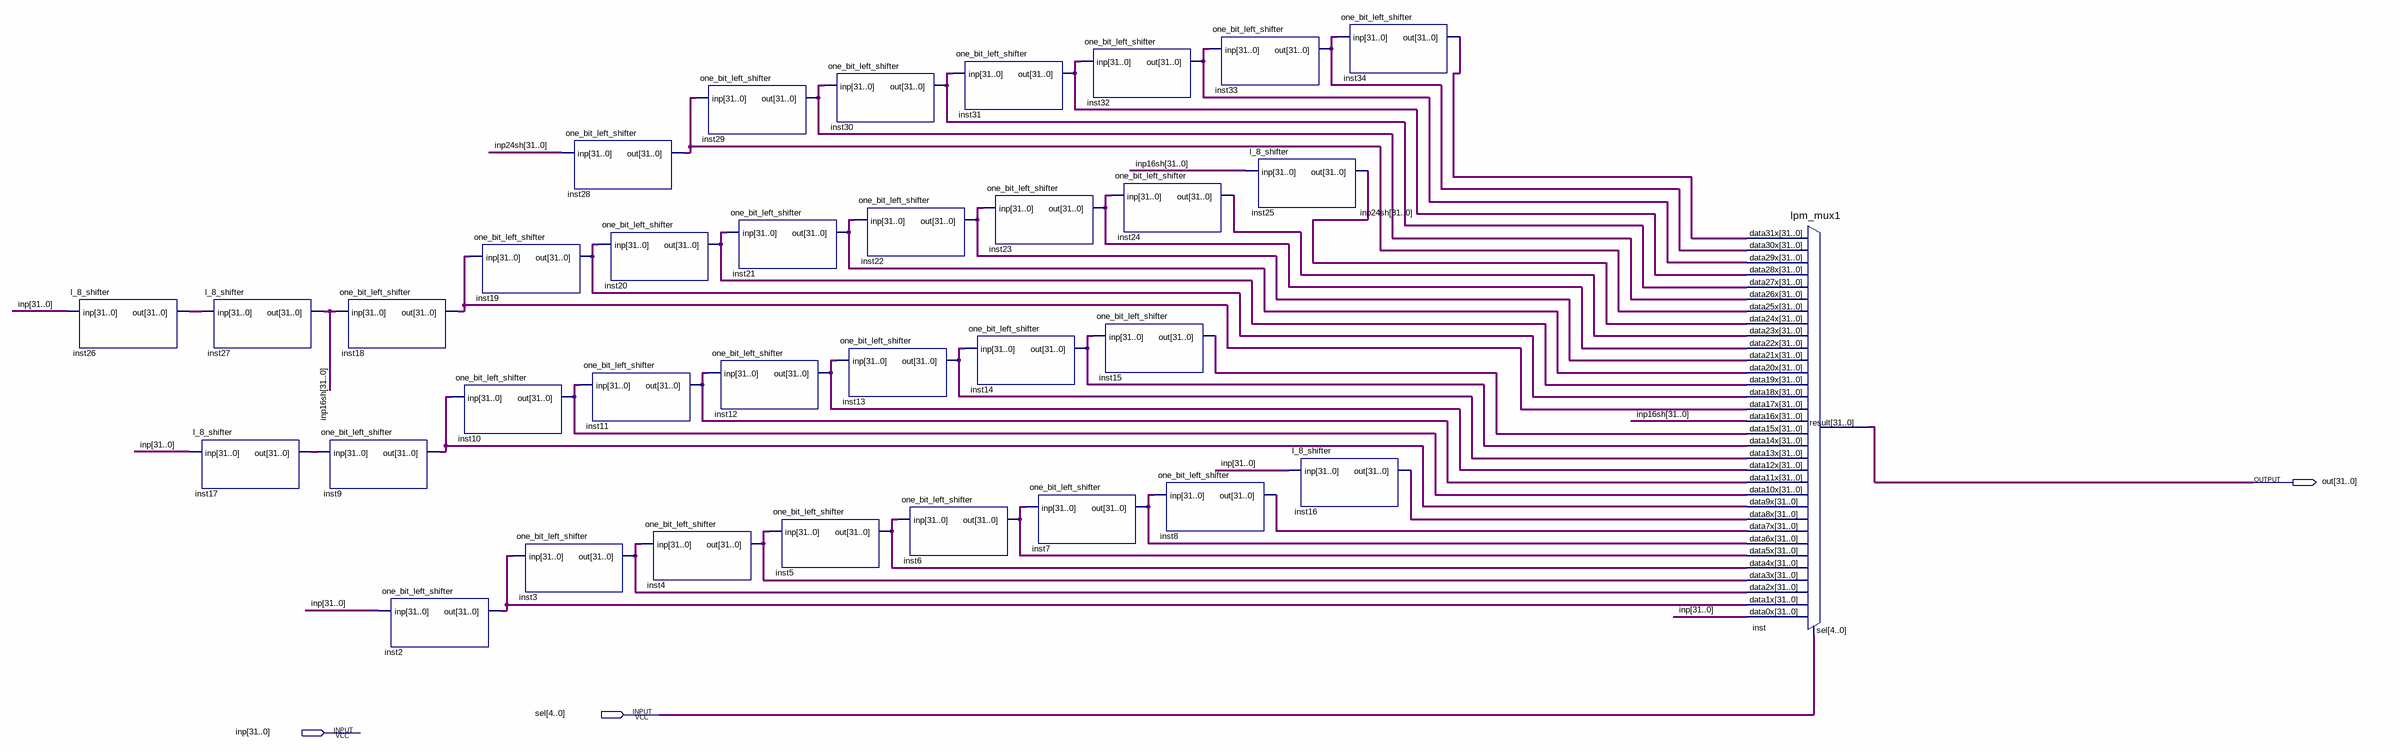
[diagram p0: schematic sheet]
// Quartus schematic left_shifter.bdf as structural Verilog: 34 symbols, 3 pins
module left_shifter (
  input  [4:0] sel,
  input  [31:0] inp,
  output [31:0] out
);

  wire [31:0] inp16sh, inp24sh, inst2_out, inst3_out, inst4_out, inst5_out, inst6_out, inst7_out, inst8_out,
       inst9_out, inst10_out, inst11_out, inst12_out, inst13_out, inst14_out, inst15_out, inst16_out,
       inst17_out, inst18_out, inst19_out, inst20_out, inst21_out, inst22_out, inst23_out, inst24_out,
       inst26_out, inst28_out, inst29_out, inst30_out, inst31_out, inst32_out, inst33_out, inst34_out;

  l_8_shifter inst26 (.inp(inp), .out(inst26_out));
  l_8_shifter inst27 (.inp(inst26_out), .out(inp16sh));
  l_8_shifter inst17 (.inp(inp), .out(inst17_out));
  one_bit_left_shifter inst18 (.inp(inp16sh), .out(inst18_out));
  one_bit_left_shifter inst9 (.inp(inst17_out), .out(inst9_out));
  one_bit_left_shifter inst2 (.inp(inp), .out(inst2_out));
  one_bit_left_shifter inst10 (.inp(inst9_out), .out(inst10_out));
  one_bit_left_shifter inst19 (.inp(inst18_out), .out(inst19_out));
  one_bit_left_shifter inst3 (.inp(inst2_out), .out(inst3_out));
  one_bit_left_shifter inst28 (.inp(inp24sh), .out(inst28_out));
  one_bit_left_shifter inst20 (.inp(inst19_out), .out(inst20_out));
  one_bit_left_shifter inst11 (.inp(inst10_out), .out(inst11_out));
  one_bit_left_shifter inst4 (.inp(inst3_out), .out(inst4_out));
  one_bit_left_shifter inst29 (.inp(inst28_out), .out(inst29_out));
  one_bit_left_shifter inst21 (.inp(inst20_out), .out(inst21_out));
  one_bit_left_shifter inst12 (.inp(inst11_out), .out(inst12_out));
  one_bit_left_shifter inst5 (.inp(inst4_out), .out(inst5_out));
  one_bit_left_shifter inst30 (.inp(inst29_out), .out(inst30_out));
  one_bit_left_shifter inst13 (.inp(inst12_out), .out(inst13_out));
  one_bit_left_shifter inst22 (.inp(inst21_out), .out(inst22_out));
  one_bit_left_shifter inst6 (.inp(inst5_out), .out(inst6_out));
  one_bit_left_shifter inst31 (.inp(inst30_out), .out(inst31_out));
  one_bit_left_shifter inst23 (.inp(inst22_out), .out(inst23_out));
  one_bit_left_shifter inst14 (.inp(inst13_out), .out(inst14_out));
  one_bit_left_shifter inst7 (.inp(inst6_out), .out(inst7_out));
  one_bit_left_shifter inst32 (.inp(inst31_out), .out(inst32_out));
  one_bit_left_shifter inst24 (.inp(inst23_out), .out(inst24_out));
  one_bit_left_shifter inst15 (.inp(inst14_out), .out(inst15_out));
  one_bit_left_shifter inst8 (.inp(inst7_out), .out(inst8_out));
  one_bit_left_shifter inst33 (.inp(inst32_out), .out(inst33_out));
  l_8_shifter inst25 (.inp(inp16sh), .out(inp24sh));
  l_8_shifter inst16 (.inp(inp), .out(inst16_out));
  one_bit_left_shifter inst34 (.inp(inst33_out), .out(inst34_out));
  lpm_mux1 inst (
    .data31x(inst34_out), .data30x(inst33_out), .data29x(inst32_out), .data28x(inst31_out),
    .data27x(inst30_out), .data26x(inst29_out), .data25x(inst28_out), .data24x(inp24sh),
    .data23x(inst24_out), .data22x(inst23_out), .data21x(inst22_out), .data20x(inst21_out),
    .data19x(inst20_out), .data18x(inst19_out), .data17x(inst18_out), .data16x(inp16sh),
    .data15x(inst15_out), .data14x(inst14_out), .data13x(inst13_out), .data12x(inst12_out),
    .data11x(inst11_out), .data10x(inst10_out), .data9x(inst9_out), .data8x(inst16_out), .data7x(inst8_out),
    .data6x(inst7_out), .data5x(inst6_out), .data4x(inst5_out), .data3x(inst4_out), .data2x(inst3_out),
    .data1x(inst2_out), .data0x(inp), .sel(sel), .result(out));
endmodule
